# Altium project NitrousController.PrjPcb
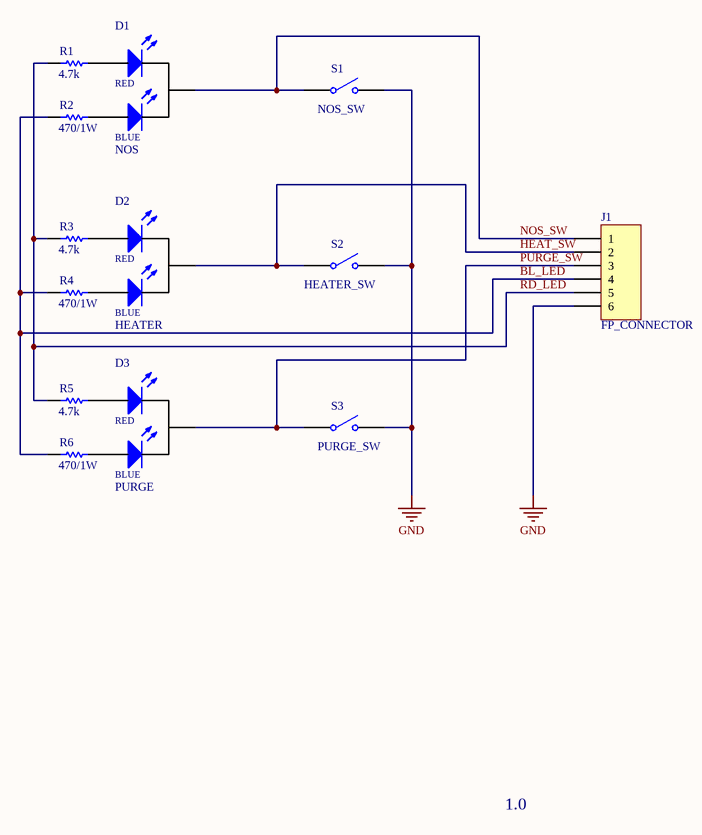
[diagram p0: Front_Panel.SchDoc]
3 sheets, 55 parts. Net scope: global (net labels, ports and power ports of the same name join across sheets).
Board files: Main_Board.PcbDoc, Head_unit.PcbDoc, Nitrous_Controller_Panel.PcbDoc
Sheets:
  Front_Panel.SchDoc
  Main_Board.SchDoc
  Car_Wiring.SchDoc

## Sheet Front_Panel.SchDoc: Nitrous Controller- Head unit
size A; DrawnBy: Stephane Gilbert

### Parts
(Parts that share a designator on the sheet are numbered #1, #2 ... from top to bottom, then left to right.)
D1  NOS
D2  HEATER
D3  PURGE
J1  FP_CONNECTOR  [MOLEX_51036_6POS]
R1  value 4.7k  [AXIAL-0.4]  (hidden comment: Res1)
R2  value 470/1W  [AXIAL-0.6]  (hidden comment: Res1)
R3  value 4.7k  [AXIAL-0.4]  (hidden comment: Res1)
R4  value 470/1W  [AXIAL-0.6]  (hidden comment: Res1)
R5  value 4.7k  [AXIAL-0.4]  (hidden comment: Res1)
R6  value 470/1W  [AXIAL-0.6]  (hidden comment: Res1)
S1#1  NOS_SW  [PA4_DPST]
S2#1  HEATER_SW  [PA4_DPST]
S3#1  PURGE_SW  [PA4_SPST]

### Nets
GND: J1.6 S1#1.2(NO) S2#1.2(NO) S3#1.2(NO)
BL_LED: J1.4 R2.1 R4.1 R6.1
HEAT_SW: D2.2(K) J1.2 S2#1.1(COMMON)
NOS_SW: D1.2(K) J1.1 S1#1.1(COMMON)
PURGE_SW: D3.2(K) J1.3 S3#1.1(COMMON)
RD_LED: J1.5 R1.1 R3.1 R5.1
NetD1_1: D1.1(A1) R1.2
NetD1_3: D1.3(A2) R2.2
NetD2_1: D2.1(A1) R3.2
NetD2_3: D2.3(A2) R4.2
NetD3_1: D3.1(A1) R5.2
NetD3_3: D3.3(A2) R6.2

### Notes on the sheet
- 1.0
- (in symbol LED_DUAL_COLOR_CC) RED; BLUE

### Library data of the parts
D1-D3 = LED_DUAL_COLOR_CC: Red/Blue LED; PartNo: XLMDKCBD59M
J1 = Header 6: Header, 6-Pin; LatestRevisionDate: 17-Jul-2002; LatestRevisionNote: Re-released for DXP Platform.; Publisher: Altium Limited
R1-R6 = Res1: Resistor; Published: 8-Jun-2000; LatestRevisionDate: 17-Jul-2002; LatestRevisionNote: Re-released for DXP Platform.; PackageReference: AXIAL-0.3; Publisher: Altium Limited; PackageDescription: Axial Device, Thru-Hole; 2 Leads; 0.3 in Pin Spacing
S1#1 S2#1 S3#1 = SW-SPST: Single-Pole, Single-Throw Switch; Published: 24-Mar-1999; LatestRevisionDate: 17-Jul-2002; LatestRevisionNote: Re-released for DXP Platform.; PackageReference: SPST-2; Publisher: Altium Limited; PackageDescription: Switch; 2 Leads

## Sheet Main_Board.SchDoc: Nitrous Controller - Control unit
size A; DrawnBy: Stephane Gilbert; DocumentNumber: Git d8883a6a4
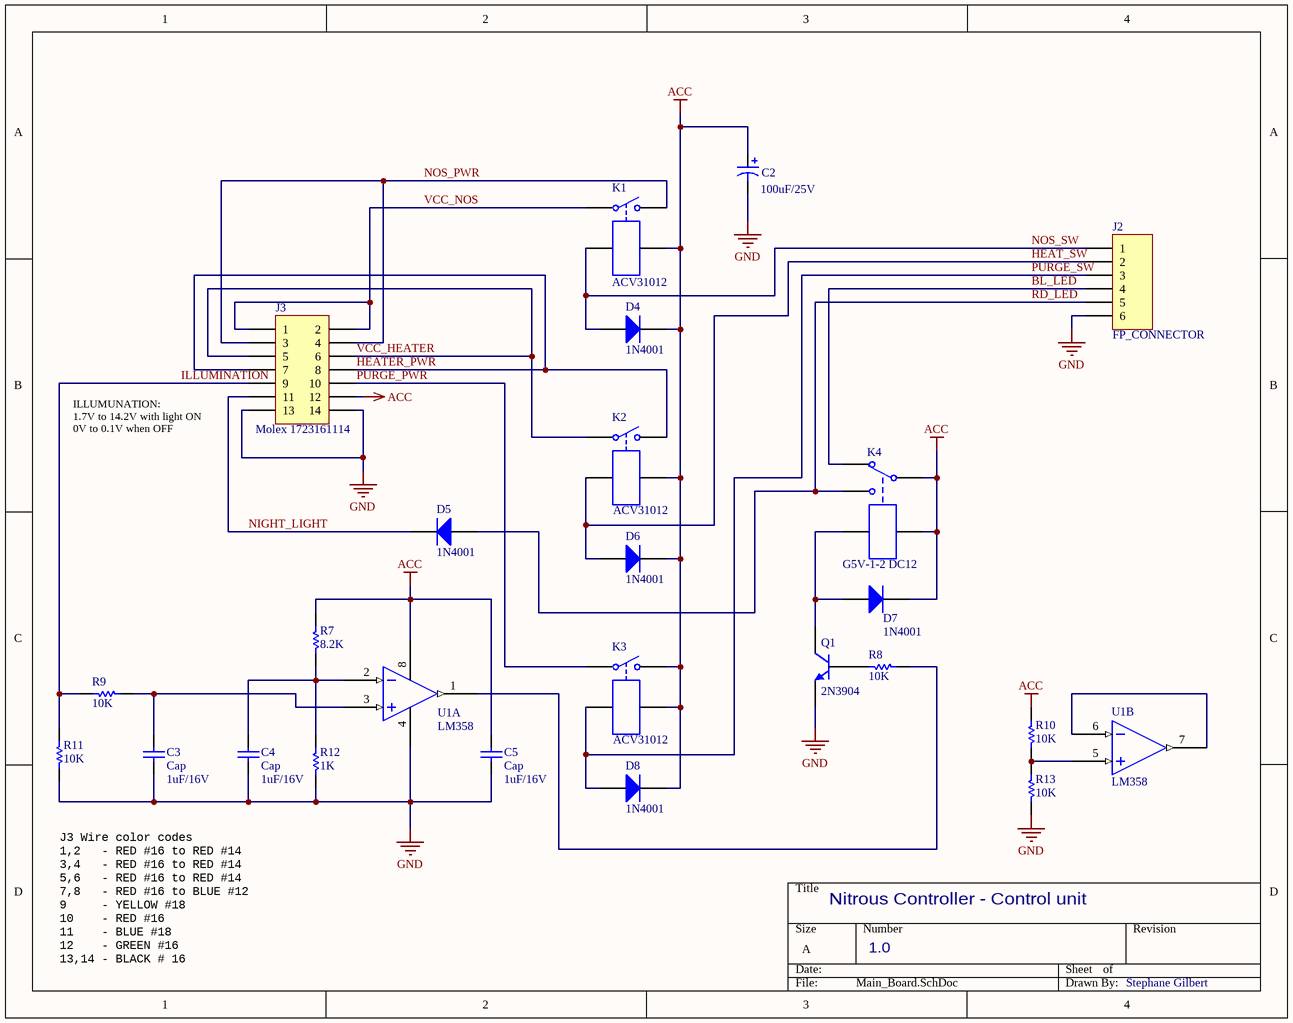
[diagram p1: Main_Board.SchDoc]

### Parts
C2  value 100uF/25V  [RB_3.5MM]  (hidden comment: Cap Pol1)
C3  Cap  value 1uF/16V  [RAD-0.2]
C4  Cap  value 1uF/16V  [RAD-0.2]
C5  Cap  value 1uF/16V  [RAD-0.2]
D4  1N4001  [DO-41]
D5  1N4001  [DO-41]
D6  1N4001  [DO-41]
D7  1N4001  [DO-41]
D8  1N4001  [DO-41]
J2  FP_CONNECTOR  [MOLEX_5329_6POS_RA]
J3  Molex 1723161114  [MOLEX_ULTRA_FIT_14_POS_RA]
K1  ACV31012  [RL_MICRO_ISO_ACV]
K2  ACV31012  [RL_MICRO_ISO_ACV]
K3  ACV31012  [RL_MICRO_ISO_ACV]
K4  G5V-1-2 DC12  [RL_G5V-1]
Q1  2N3904  [TO-92]
R7  value 8.2K  [AXIAL-0.4]  (hidden comment: Res1)
R8  value 10K  [AXIAL-0.4]  (hidden comment: Res1)
R9  value 10K  [AXIAL-0.4]  (hidden comment: Res1)
R10  value 10K  [AXIAL-0.4]  (hidden comment: Res1)
R11  value 10K  [AXIAL-0.4]  (hidden comment: Res1)
R12  value 1K  [AXIAL-0.4]  (hidden comment: Res1)
R13  value 10K  [AXIAL-0.4]  (hidden comment: Res1)
U1  LM358  [DIP-8]  (parts A,B of 2)

### Nets
ACC: C2.1 C5.2 D4.2(K) D6.2(K) D7.2(K) D8.2(K) J3.12 K1.4 K2.4 K3.2 K3.4 K4.1 K4.4 R7.1 R10.1 U1.8
GND: C2.2 C3.1 C4.1 C5.1 J2.6 J3.13 J3.14 Q1.3(E) R11.1 R12.2 R13.1 U1.4
BL_LED: J2.4 K4.2
HEAT_SW: D6.1(A) J2.2 K2.3
HEATER_PWR: J3.7 J3.8 K2.2
ILLUMINATION: J3.9 R9.2 R11.2
NIGHT_LIGHT: D5.2(K) J3.11
NOS_PWR: J3.3 J3.4 K1.2
NOS_SW: D4.1(A) J2.1 K1.3
PURGE_PWR: J3.10 K3.1
PURGE_SW: D8.1(A) J2.3 K3.3
RD_LED: D5.1(A) J2.5 K4.3
VCC_HEATER: J3.5 J3.6 K2.1
VCC_NOS: J3.1 J3.2 K1.1
NetC3_2: C3.2 R9.1 U1.3
NetC4_2: C4.2 R7.2 R12.1 U1.2
NetD7_1: D7.1(A) K4.5 Q1.1(C)
NetQ1_2: Q1.2(B) R8.2
NetR8_1: R8.1 U1.1
NetR10_2: R10.2 R13.2 U1.5
NetU1_6: U1.6 U1.7

### Notes on the sheet
- ILLUMUNATION:
  1.7V to 14.2V with light ON
  0V to 0.1V when OFF
- J3 Wire color codes
  1,2   - RED #16 to RED #14
  3,4   - RED #16 to RED #14
  5,6   - RED #16 to RED #14
  7,8   - RED #16 to BLUE #12
  9     - YELLOW #18
  10    - RED #16
  11    - BLUE #18
  12    - GREEN #16
  13,14 - BLACK # 16
- 1.0

### Library data of the parts
C2 = Cap Pol1: UBW1E101MPD1TD; Published: 8-Jun-2000; LatestRevisionDate: 17-Jul-2002; LatestRevisionNote: Re-released for DXP Platform.; PackageReference: RB7.6-15; Publisher: Altium Limited; PackageDescription: Polarized Capacitor (Radial); 2 Leads
C3-C5 = Cap: FA26X8R1E105KNU06; Published: 8-Jun-2000; LatestRevisionDate: 17-Jul-2002; LatestRevisionNote: Re-released for DXP Platform.; PackageReference: RAD-0.3; Publisher: Altium Limited; PackageDescription: Radial Cap, Thru-Hole; 2 Leads; 0.3 in Pin Spacing
D4-D8 = Diode 1N4001: 1 Amp General Purpose Rectifier; Published: 8-Jun-2000; LatestRevisionDate: 17-Jul-2002; LatestRevisionNote: Re-released for DXP Platform.; DatasheetVersion: 1998; PackageVersion: Aug-1999; PackageReference: DO-41; Publisher: Altium Limited; PackageDescription: Diode, Axial; Body 5.2 x 2.7 mm (LxDia. max), Lead Dia. 0.86 mm (max); Code_JEDEC: DO-204-AL; ComponentLink1Description: Manufacturer Link; ComponentLink1URL: http://www.fairchildsemi.com/; ComponentLink2Description: Datasheet; ComponentLink2URL: http://www.fairchildsemi.com/ds/1N%2F1N4001.pdf
J2 = Header 6: Header, 6-Pin; LatestRevisionDate: 17-Jul-2002; LatestRevisionNote: Re-released for DXP Platform.; Publisher: Altium Limited
J3 = Header 7X2: Header, 7-Pin, Dual row; LatestRevisionDate: 17-Jul-2002; LatestRevisionNote: Re-released for DXP Platform.; Publisher: Altium Limited
K1-K3 = Relay-SPST: Single-Pole Single-Throw Relay; pin to pad: 1>3 2>5 3>1 4>2; Published: 24-Mar-1999; LatestRevisionDate: 17-Jul-2002; LatestRevisionNote: Re-released for DXP Platform.; PackageReference: MODULE4; Publisher: Altium Limited
K4 = Relay-SPDT: Single-Pole Dual-Throw Relay; pin to pad: 1>5 2>1 3>10 4>9 5>2; Published: 24-Mar-1999; LatestRevisionDate: 17-Jul-2002; LatestRevisionNote: Re-released for DXP Platform.; PackageReference: MODULE5B; Publisher: Altium Limited
Q1 = NPN: NPN Bipolar Transistor; Published: 8-Jun-2000; LatestRevisionDate: 17-Jul-2002; LatestRevisionNote: Re-released for DXP Platform.; PackageReference: TO-226-AA; Publisher: Altium Limited; PackageDescription: TO, Flat Index; 3 In-Line, Axial Leads; Body Dia. 4.8mm; Leads 0.55 x 0.51 mm (max); Code_JEDEC: TO-226-AA
R7-R13 = Res1: Resistor; Published: 8-Jun-2000; LatestRevisionDate: 17-Jul-2002; LatestRevisionNote: Re-released for DXP Platform.; PackageReference: AXIAL-0.3; Publisher: Altium Limited; PackageDescription: Axial Device, Thru-Hole; 2 Leads; 0.3 in Pin Spacing

## Sheet Car_Wiring.SchDoc
size Tabloid
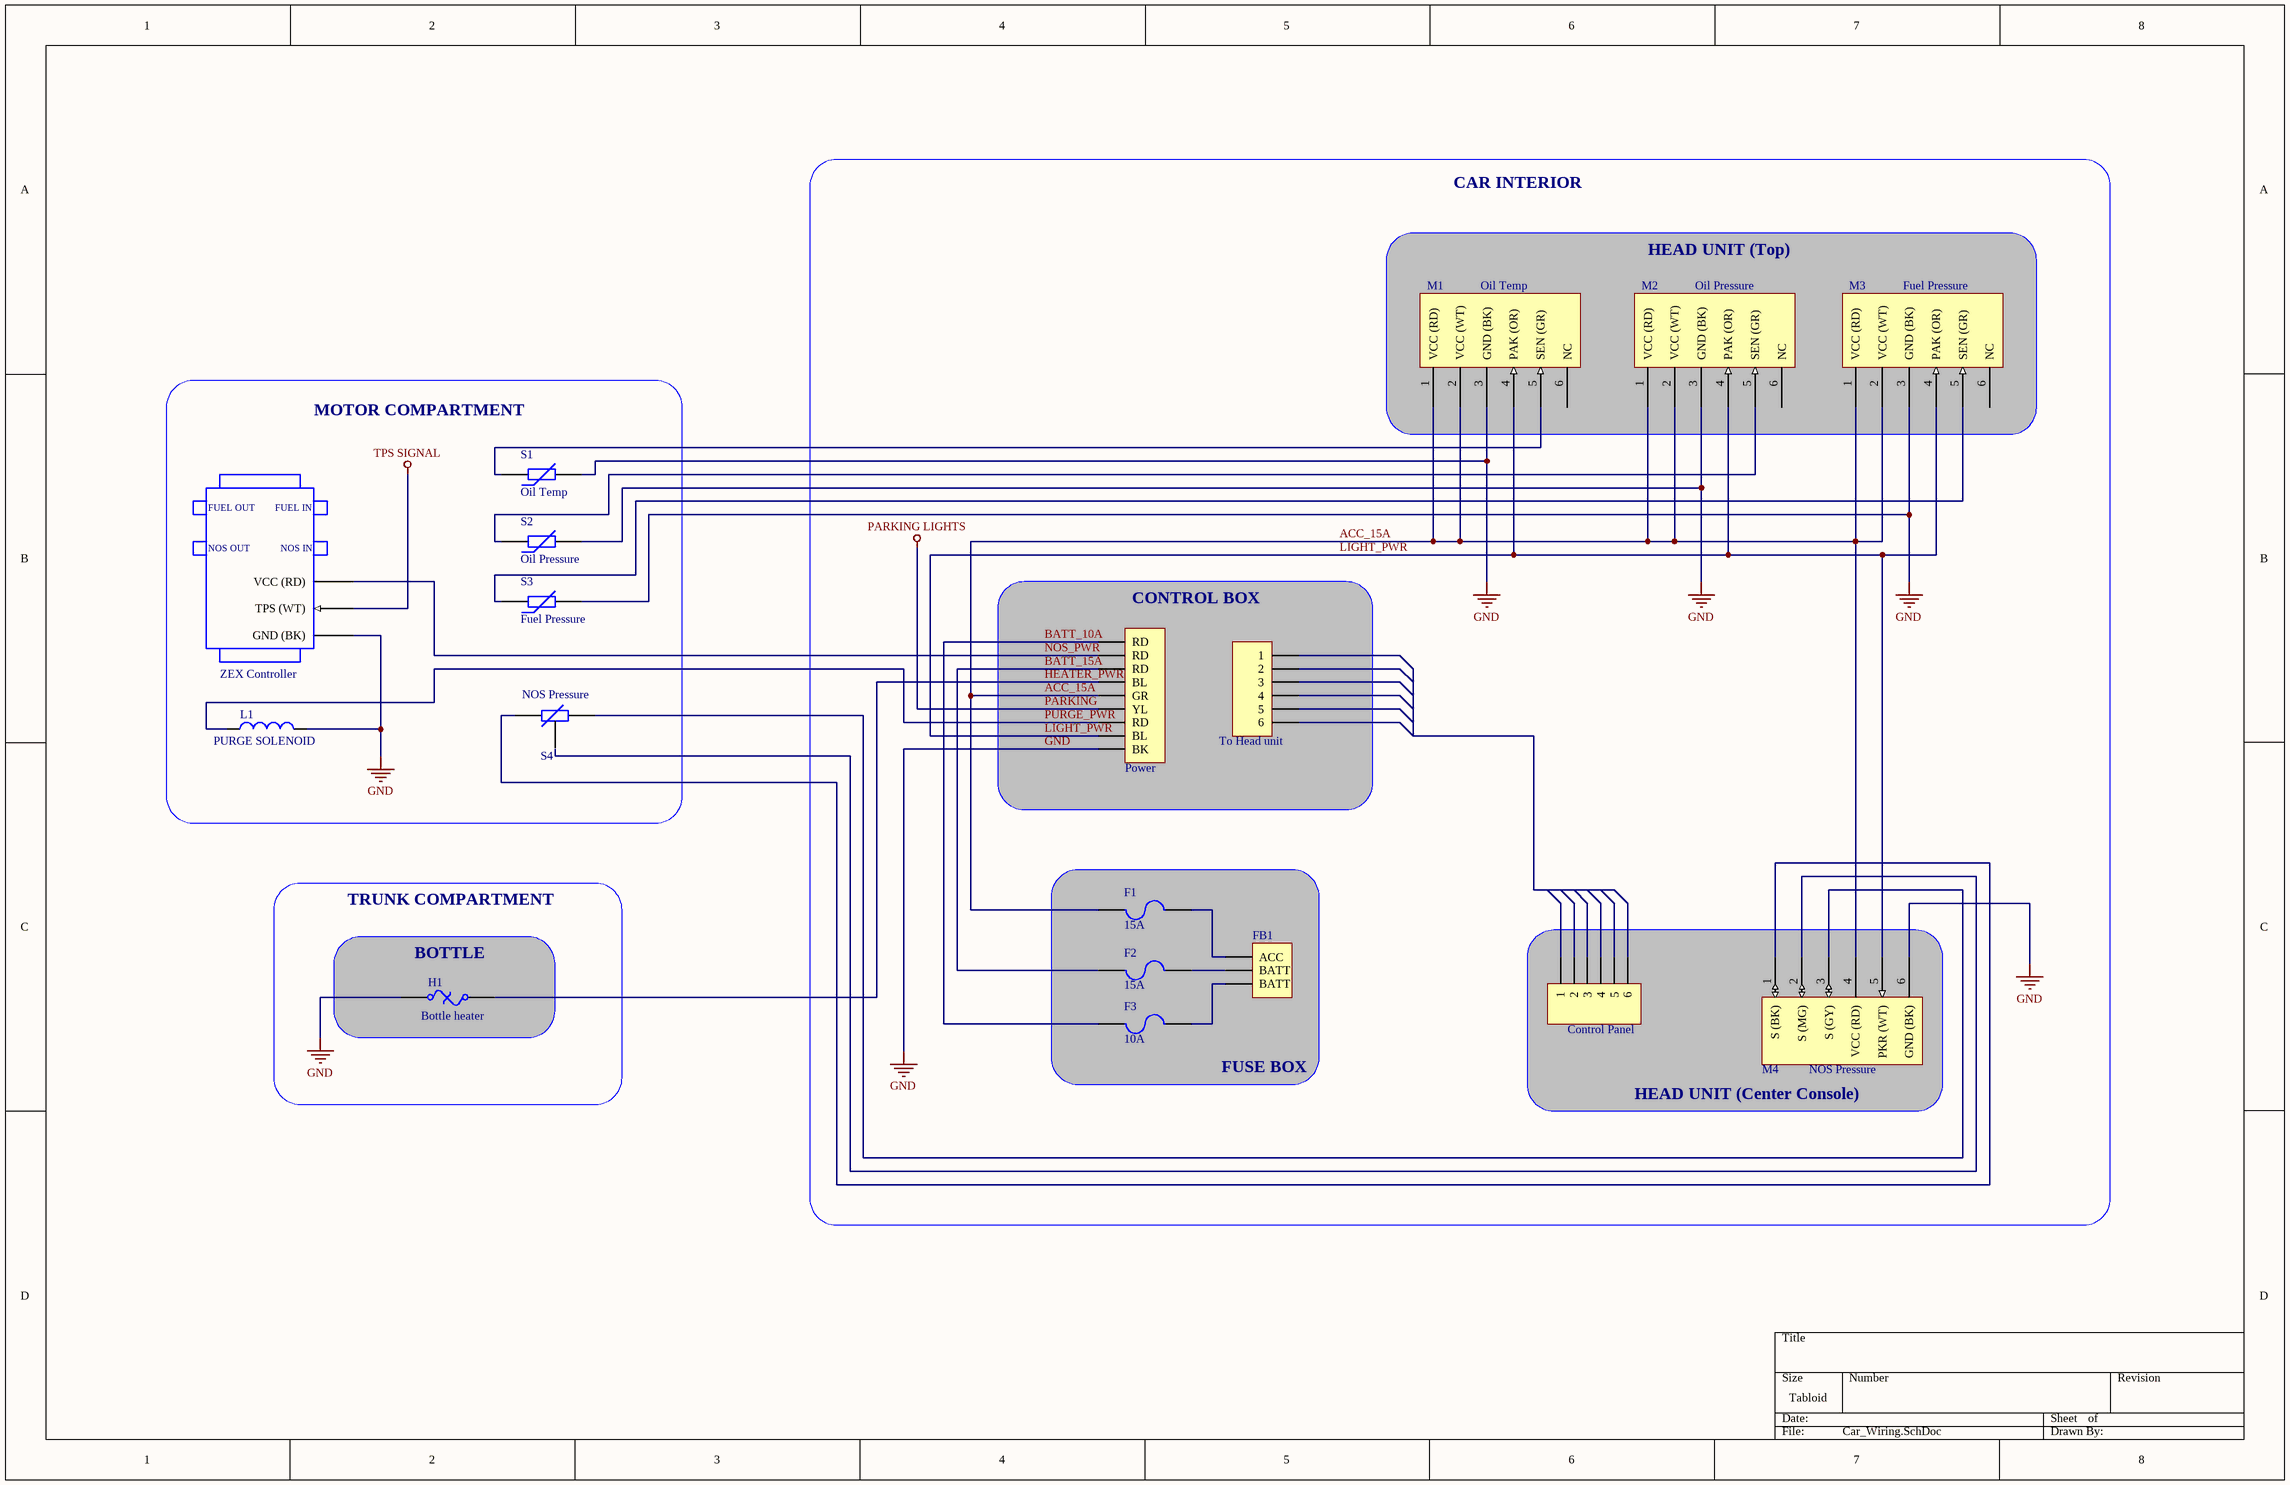
[diagram p2: Car_Wiring.SchDoc]

### Parts
(Parts that share a designator on the sheet are numbered #1, #2 ... from top to bottom, then left to right.)
?#1  Power  [MHDR1X9]
?#2  To Head unit  [MOLEX_5329_6POS_RA]
?#3  Control Panel  [MOLEX_51036_6POS]
CT1  ZEX Controller
F1  15A  [PIN-W2/E2.8]
F2  15A  [PIN-W2/E2.8]
F3  10A  [PIN-W2/E2.8]
FB1  (no value)  [MHDR1X3]
H1  Bottle heater  [PIN-W2/E2.8]
L1  PURGE SOLENOID  [0402-A]
M1  Oil Temp
M2  Oil Pressure
M3  Fuel Pressure
M4  NOS Pressure
S1#2  Oil Temp  [6-0805_L]
S2#2  Oil Pressure  [6-0805_L]
S3#2  Fuel Pressure  [6-0805_L]
S4  NOS Pressure

### Blocks framed on the sheet
HEAD UNIT (Top): M1-M3
MOTOR COMPARTMENT: CT1 L1 S1#2 S2#2 S3#2 S4
CONTROL BOX: ?#1 ?#2
FUSE BOX: F1-F3 FB1
BOTTLE: H1
HEAD UNIT (Center Console): ?#3 M4

### Nets
GND: ?#1.9(BK) CT1.1(GND_(BK)) H1.1 L1.2 M1.3(GND_(BK)) M2.3(GND_(BK)) M3.3(GND_(BK)) M4.6(GND_(BK)) S1#2.2 S2#2.2 S3#2.2
PARKING: ?#1.6(YL)  [also labelled PARKING LIGHTS]
TPS SIGNAL: CT1.2(TPS_(WT))
ACC_15A: ?#1.5(GR) F1.2 M1.1(VCC_(RD)) M1.2(VCC_(WT)) M2.1(VCC_(RD)) M2.2(VCC_(WT)) M3.1(VCC_(RD)) M3.2(VCC_(WT)) M4.4(VCC_(RD))
BATT_10A: ?#1.1(RD) F3.2
BATT_15A: ?#1.3(RD) F2.2
HEATER_PWR: ?#1.4(BL) H1.2
LIGHT_PWR: ?#1.8(BL) M1.4(PAK_(OR)) M2.4(PAK_(OR)) M3.4(PAK_(OR)) M4.5(PKR_(WT))
NOS_PWR: ?#1.2(RD) CT1.3(VCC_(RD))
PURGE_PWR: ?#1.7(RD) L1.1
NetF1_1: F1.1 FB1.1(ACC)
NetF2_1: F2.1 FB1.2(BATT)
NetF3_1: F3.1 FB1.3(BATT)
NetM1_5: M1.5(SEN_(GR)) S1#2.1
NetM2_5: M2.5(SEN_(GR)) S2#2.1
NetM3_5: M3.5(SEN_(GR)) S3#2.1
NetM4_1: M4.1(S_(BK)) S4.2
NetM4_3: M4.3(S_(GY)) S4.1

Not connected (* = marked no-connect by the designer): ?#2 1 2 3 4 5 6; ?#3 1 2 3 4 5 6; M1 6(NC); M2 6(NC); M3 6(NC); M4 2(S_(MG)); S4 3

### Notes on the sheet
- CAR INTERIOR
- TRUNK COMPARTMENT
- (in symbol NOS_CTRL_UNIT) FUEL OUT; FUEL IN; NOS OUT; NOS IN

### Library data of the parts
?#1 = MHDR1X9: Header, 9-Pin; LatestRevisionDate: 17-Jul-2002; LatestRevisionNote: Re-released for DXP Platform.; Publisher: Altium Limited
?#2 ?#3 = Header 6: Header, 6-Pin; LatestRevisionDate: 17-Jul-2002; LatestRevisionNote: Re-released for DXP Platform.; Publisher: Altium Limited
CT1 = NOS_CTRL_UNIT
F1-F3 = Fuse 2: Fuse; Published: 8-Jun-2000; LatestRevisionDate: 17-Jul-2002; LatestRevisionNote: Re-released for DXP Platform.; PackageReference: PIN-W2/E2.8; Publisher: Altium Limited; PackageDescription: Thru-Hole; 2 Leads
FB1 = MHDR1X3: Header, 3-Pin; LatestRevisionDate: 17-Jul-2002; LatestRevisionNote: Re-released for DXP Platform.; Publisher: Altium Limited
H1 = Fuse Thermal: Thermal Fuse; Published: 24-Mar-1999; LatestRevisionDate: 17-Jul-2002; LatestRevisionNote: Re-released for DXP Platform.; PackageReference: PIN-W2/E2.8; Publisher: Altium Limited; PackageDescription: Thru-Hole; 2 Leads
L1 = Inductor: Code_IEC: 1005; Published: 8-Jun-2000; LatestRevisionDate: 29-May-2009; LatestRevisionNote: IPC-7351 Footprint Added.; PackageReference: 0402-A; Publisher: Altium Limited; PackageDescription: Chip Inductor; Code_JEITA: 0402
M1-M3 = PS_GAUGE
M4 = AM_GAUGE
S1#2 S2#2 S3#2 = Res Varistor: Varistor (Voltage-Sensitive Resistor); Published: 24-Mar-1999; LatestRevisionDate: 29-May-2009; LatestRevisionNote: IPC-7351 Footprint Added.; PackageVersion: Mar-2003; PackageReference: 6-0805; Publisher: Altium Limited; PackageDescription: Chip Resistor 0805 Case Size; Code_IPC: RESC2012
S4 = TEMP_SENSOR

## Nets that join several sheets
GND: Front_Panel (J1.6 S1#1.2 S2#1.2 S3#1.2), Main_Board (12 pins), Car_Wiring (11 pins)
BL_LED: Front_Panel (J1.4 R2.1 R4.1 R6.1), Main_Board (J2.4 K4.2)
HEAT_SW: Front_Panel (D2.2 J1.2 S2#1.1), Main_Board (D6.1 J2.2 K2.3)
HEATER_PWR: Main_Board (J3.7 J3.8 K2.2), Car_Wiring (?#1.4 H1.2)
NOS_PWR: Main_Board (J3.3 J3.4 K1.2), Car_Wiring (?#1.2 CT1.3)
NOS_SW: Front_Panel (D1.2 J1.1 S1#1.1), Main_Board (D4.1 J2.1 K1.3)
PURGE_PWR: Main_Board (J3.10 K3.1), Car_Wiring (?#1.7 L1.1)
PURGE_SW: Front_Panel (D3.2 J1.3 S3#1.1), Main_Board (D8.1 J2.3 K3.3)
RD_LED: Front_Panel (J1.5 R1.1 R3.1 R5.1), Main_Board (D5.1 J2.5 K4.3)